# Altium schematic sheet PowerManagement.SchDoc: Power
size A3; SheetNumber: 2; SheetTotal: 4
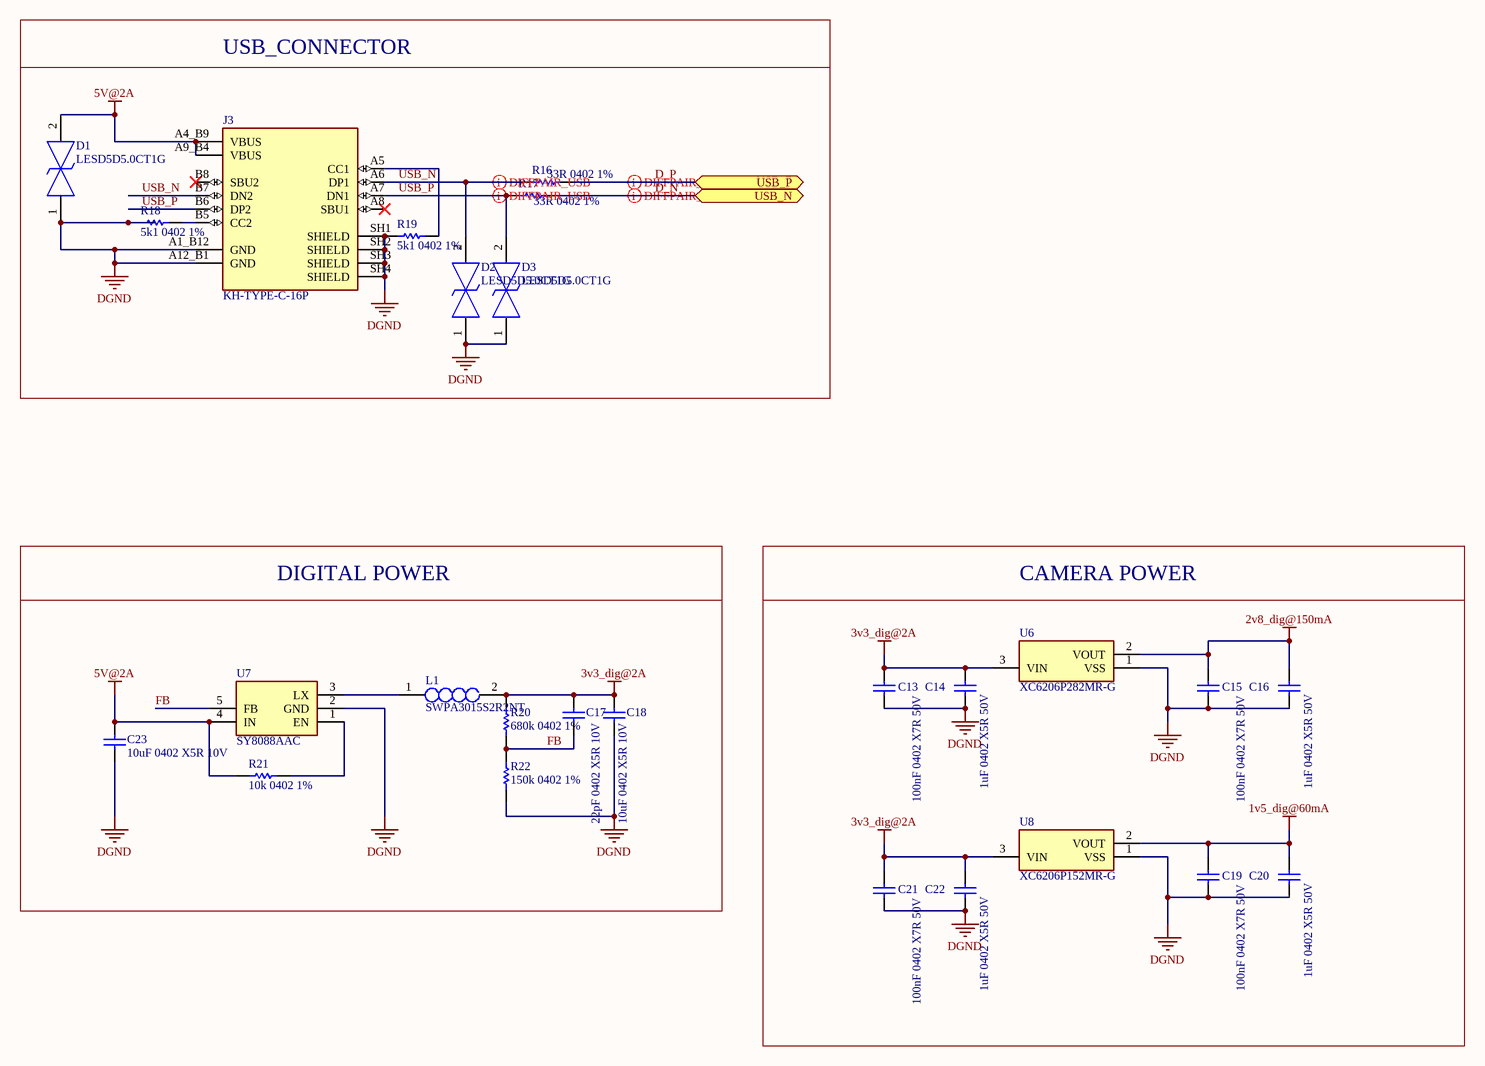
[diagram p0: PowerManagement.SchDoc]

## Parts
C13  100nF 0402 X7R 50V  [CAPC1005X55X25NL5T10]
C14  1uF 0402 X5R 50V  [CAPC1005X55X25NL5T10]
C15  100nF 0402 X7R 50V  [CAPC1005X55X25NL5T10]
C16  1uF 0402 X5R 50V  [CAPC1005X55X25NL5T10]
C17  22pF 0402 X5R 10V  [CAPC1005X55X25NL5T10]
C18  10uF 0402 X5R 10V  [CAPC1005X55X25NL5T10]
C19  100nF 0402 X7R 50V  [CAPC1005X55X25NL5T10]
C20  1uF 0402 X5R 50V  [CAPC1005X55X25NL5T10]
C21  100nF 0402 X7R 50V  [CAPC1005X55X25NL5T10]
C22  1uF 0402 X5R 50V  [CAPC1005X55X25NL5T10]
C23  10uF 0402 X5R 10V  [CAPC1005X55X25NL5T10]
D1  LESD5D5.0CT1G  [LESD5D50CT1G]
D2  LESD5D5.0CT1G  [LESD5D50CT1G]
D3  LESD5D5.0CT1G  [LESD5D50CT1G]
J3  KH-TYPE-C-16P  [KINGHELM_KH-TYPE-C-16P]
L1  SWPA3015S2R2NT  [INDPM3030X150N]
R16  33R 0402 1%  [RESC1005X40X25ML05T10]
R17  33R 0402 1%  [RESC1005X40X25ML05T10]
R18  5k1 0402 1%  [RESC1005X40X25ML05T10]
R19  5k1 0402 1%  [RESC1005X40X25ML05T10]
R20  680k 0402 1%  [RESC1005X40X25ML05T10]
R21  10k 0402 1%  [RESC1005X40X25ML05T10]
R22  150k 0402 1%  [RESC1005X40X25ML05T10]
U6  XC6206P282MR-G  [SOT95P280X130-3N]
U7  SY8088AAC  [SOT95P285X140-5N]
U8  XC6206P152MR-G  [SOT95P280X130-3N]

## Blocks framed on the sheet
USB_CONNECTOR: D1-D3 J3 R16-R19
DIGITAL POWER: C17 C18 C23 L1 R20-R22 U7
CAMERA POWER: C13-C16 C19-C22 U6 U8

## Ports
USB_N (bidir), USB_P (bidir)

## Nets
1v5_dig@60mA: C19.2 C20.2 U8.2(VOUT)
2v8_dig@150mA: C15.2 C16.2 U6.2(VOUT)
3v3_dig@2A: C13.2 C14.2 C17.1 C18.1 C21.2 C22.2 L1.2 R20.1 U6.3(VIN) U8.3(VIN)
5V@2A: C23.1 D1.2 J3.A4_B9(VBUS) J3.A9_B4(VBUS) R21.1 U7.4(IN)
DGND: C13.1 C14.1 C15.1 C16.1 C18.2 C19.1 C20.1 C21.1 C22.1 C23.2 D1.1 D2.1 D3.1 J3.A1_B12(GND) J3.A12_B1(GND) J3.SH1(SHIELD) J3.SH2(SHIELD) J3.SH3(SHIELD) J3.SH4(SHIELD) R18.1 R19.1 R22.2 U6.1(VSS) U7.2(GND) U8.1(VSS)
D_N: R17.2 ; port USB_N
D_P: R16.2 ; port USB_P
FB: C17.2 R20.2 R22.1 U7.5(FB)
USB_N: D2.2 J3.A6(DP1) J3.B7(DN2) R16.1
USB_P: D3.2 J3.A7(DN1) J3.B6(DP2) R17.1
NetJ3_A5: J3.A5(CC1) R19.2
NetJ3_B5: J3.B5(CC2) R18.2
NetL1_1: L1.1 U7.3(LX)
NetR21_2: R21.2 U7.1(EN)

Not connected (* = marked no-connect by the designer): J3 A8(SBU1)* B8(SBU2)*

## Layout directives
differential pair; differential pair class USB: D_N, D_P, USB_N, USB_P

## Notes on the sheet
- Title
- Size:
- Date:
- A3
- Author:
- Time:
- Revision:
- Sheet
- of
- File:

## Library data of the parts
C13-C23 = CMP-1662-00020-1: ComponentLink2Description: Datasheet; ComponentLink2URL: http://psearch.en.murata.com/capacitor/product/GRM155R60J105KE19%23.pdf; ComponentLink1Description: Manufacturer URL; ComponentLink1URL: http://www.murata.com/
  C13 C15 C19 C21: LCSC_PN: C77020
  C14 C16 C20 C22: LCSC_PN: C1518208
  C17: LCSC_PN: C106203
  C18 C23: LCSC_PN: C77000
D1-D3 = LESD5D5.0CT1G: TVS Diode (Bi-directional); Manufacturer_Name: LRC; Height: 0.7mm; Manufacturer_Part_Number: LESD5D5.0CT1G; LCSC_PN: C5274290
J3 = KH-TYPE-C-16P: MF: kinghelm; SnapEDA_Link: https://www.snapeda.com/parts/KH-TYPE-C-16P/Kinghelm/view-part/?ref=snap; Package: None; Value: *; MP: KH-TYPE-C-16P; Check_prices: https://www.snapeda.com/parts/KH-TYPE-C-16P/Kinghelm/view-part/?ref=eda; LCSC_PN: C709357
L1 = SWPA3015S2R2NT: Inductor; Manufacturer_Name: SUNLORD; Datasheet Link: https://www.datasheets360.com/pdf/-6416416511052712578; Height: 1.5mm; Manufacturer_Part_Number: SWPA3015S2R2NT; LCSC_PN: C19734
R16-R22 = CMP-2002-07472-1
  R16 R17: LCSC_PN: C138002
  R18 R19: LCSC_PN: C105872
  R20: LCSC_PN: C163456
  R21: LCSC_PN: C60490
  R22: LCSC_PN: C93947
U6 = XC6206P282MR-G: Integrated Circuit; Manufacturer_Name: Torex; Datasheet Link: https://www.torexsemi.com/file/xc6206/XC6206.pdf; Height: 1.3mm; Manufacturer_Part_Number: XC6206P282MR-G; Mouser Part Number: 865-XC6206P282MR-G; Mouser Price/Stock: https://www.mouser.co.uk/ProductDetail/Torex-Semiconductor/XC6206P282MR-G?qs=AsjdqWjXhJ%2Fpd3DOBopSeA%3D%3D; LCSC_PN: C347374
U7 = SY8088AAC: Integrated Circuit; Manufacturer_Name: Silergy; Datasheet Link: https://lcsc.com/product-detail/DC-DC-Converters_Silergy_SY8088AAC_SY8088AAC_C79313.html; Height: 1.4mm; Manufacturer_Part_Number: SY8088AAC; LCSC_PN: C79313
U8 = XC6206P152MR-G: Integrated Circuit; Manufacturer_Name: Torex; Datasheet Link: https://www.torexsemi.com/file/xc6206/XC6206.pdf; Height: 1.3mm; Manufacturer_Part_Number: XC6206P152MR-G; Mouser Part Number: 865-XC6206P152MR-G; Mouser Price/Stock: https://www.mouser.co.uk/ProductDetail/Torex-Semiconductor/XC6206P152MR-G?qs=AsjdqWjXhJ%2FTdxm%252B3lQcfQ%3D%3D; LCSC_PN: C424701